# EAGLE design power_hub (EAGLE 9.1.0)
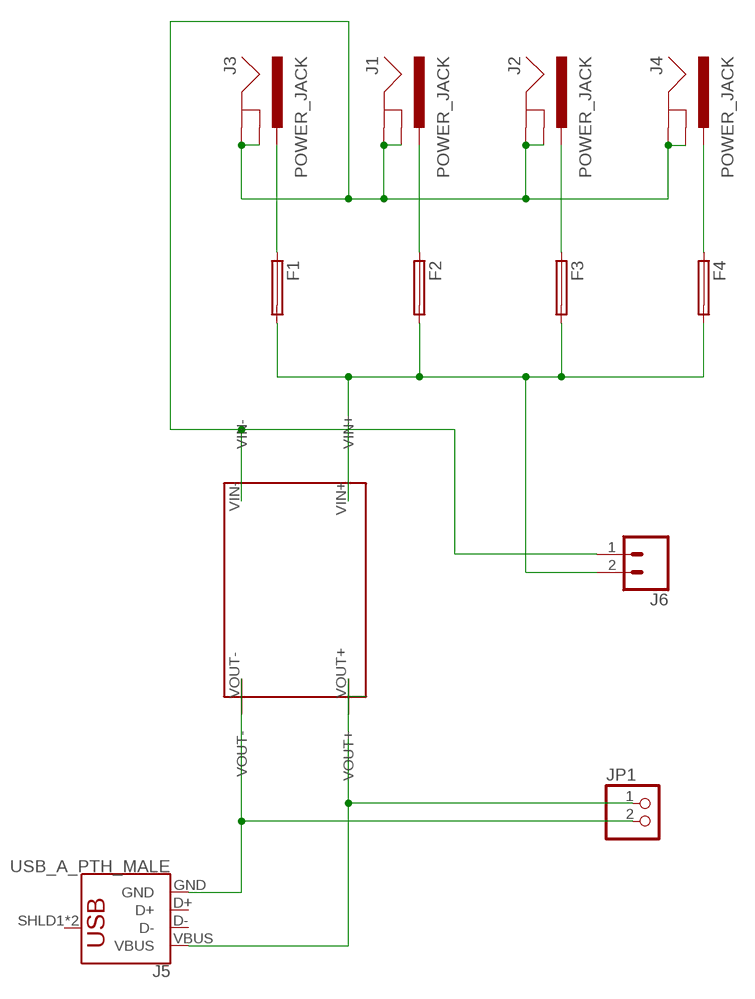
[diagram p0: schematic, sheet 1]

## Parts
F1  GSH15  [GSH15]
F2  GSH15  [GSH15]
F3  GSH15  [GSH15]
F4  GSH15  [GSH15]
J1  POWER_JACK  [POWER_JACK_PTH]
J2  POWER_JACK  [POWER_JACK_PTH]
J3  POWER_JACK  [POWER_JACK_PTH]
J4  POWER_JACK  [POWER_JACK_PTH]
J5  USB_A_PTH_MALE  [USB-A-H]
J6  CONN_023.5MM  [SCREWTERMINAL-3.5MM-2]
JP1  PINHD-1X2  [1X02]
U$1  DCPOWERCONV_PHUB  [DCPOWERCONV_PHUB]

## Nets
N$1: F1.1 J3.PWR
N$2: F2.1 J1.PWR
N$3: F3.1 J2.PWR
N$4: J5.VBUS JP1.1 U$1.VOUT+
N$5: F1.2 F2.2 F3.2 F4.2 J6.2 U$1.VIN+
N$6: F4.1 J4.PWR
N$9: J5.GND JP1.2 U$1.VOUT-
N$10: J1.GND J1.GNDBREAK J2.GND J2.GNDBREAK J3.GND J3.GNDBREAK J4.GND J4.GNDBREAK J6.1 U$1.VIN-
Unconnected: J5.D+ J5.D- J5.SHLD1(SHIELD) J5.SHLD2(SHIELD)

## Library data of the parts
F1-F4 = fuse:GSH15: FUSE HOLDER grid 15mm, 19649 Wickmann; MPN: 64900001039; OC_FARNELL: 1271673; OC_NEWARK: 02P0318
J1-J4 = SparkFun-Connectors:POWER_JACK: Power Jack Connector This is the standard 5.5mm barrel jack for power. The PTH is the most common, proven, reliable, footprint. The Slot footprint only works if the mill layer is transmitted to the PCB fab house so be warned. Here are the connectors we sell at SparkFun: DC Barrel Power Jack/Connector <https://www.sparkfun.com/products/119> (PRT-00119) DC Barrel Power Jack/Connector (SMD) <https://www.sparkfun.com/products/12748> (PRT-12748) DC Barrel Jack Adapter - Breadboard Compatible <https://www.sparkfun.com/products/10811> (PRT-10811) It is used on this SparkFun product (and many, many others): SparkFun RedBoard - Programmed with Arduino <https://www.sparkfun.com/products/12757> (DEV-12757) Also, if you need a mating power supply or connector, please check these out: Wall Adapter Power Supply - 9VDC 650mA <https://www.sparkfun.com/products/298> (TOL-00298) DC Barrel Jack Adapter - Male <https://www.sparkfun.com/products/10287> (PRT-10287); PROD_ID: CONN-08197
J5 = SparkFun-Connectors:USB_A: USB-A Connector Male and female variants, as well as PTH and SMT variants SparkFun Products: SparkFun XBee Explorer Dongle <https://www.sparkfun.com/products/11697> PTH Male SparkFun MicroView-USB Programmer <https://www.sparkfun.com/products/12924> SMT Male SparkFun USB Type A Female Breakout <https://www.sparkfun.com/products/12700> SMT Female; PROD_ID: CONN-08367; SF_ID: PRT-00437
J6 = SparkFun-Connectors:CONN_02: Multi connection point. Often used as Generic Header-pin footprint for 0.1 inch spaced/style header connections On any of the 0.1 inch spaced packages, you can populate with these: Break Away Headers - Straight <https://www.sparkfun.com/products/116> (PRT-00116) Break Away Male Headers - Right Angle <https://www.sparkfun.com/products/553> (PRT-00553) Female Headers <https://www.sparkfun.com/products/115> (PRT-00115) Break Away Headers - Machine Pin <https://www.sparkfun.com/products/117> (PRT-00117) Break Away Female Headers - Swiss Machine Pin <https://www.sparkfun.com/products/743> (PRT-00743) For SCREWTERMINALS and SPRING TERMINALS visit here: Screw Terimnals on SparkFun.com <https://www.sparkfun.com/search/results?term=Screw+Terminals> (5mm/3.5mm/2.54mm spacing) This device is also useful as a general connection point to wire up your design to another part of your project. Our various solder wires solder well into these plated through hole pads. Hook-Up Wire - Assortment (Stranded, 22 AWG) <https://www.sparkfun.com/products/11375> (PRT-11375) Hook-Up Wire - Assortment (Solid Core, 22 AWG) <https://www.sparkfun.com/products/11367> (PRT-11367) View the entire wire category on our website here <https://www.sparkfun.com/categories/141> Special notes: Molex polarized connector foot print use with: PRT-08233 with associated crimp pins and housings. 2.54_SCREWTERM for use with PRT-10571. 3.5mm Screw Terminal footprints for PRT-08084 5mm Screw Terminal footprints for use with PRT-08432; PROD_ID: CONN-08399
JP1 = pinhead:PINHD-1X2: PIN HEADER
U$1 = astropipower:DCPOWERCONV_PHUB: DC to DC Power Converter

## Board
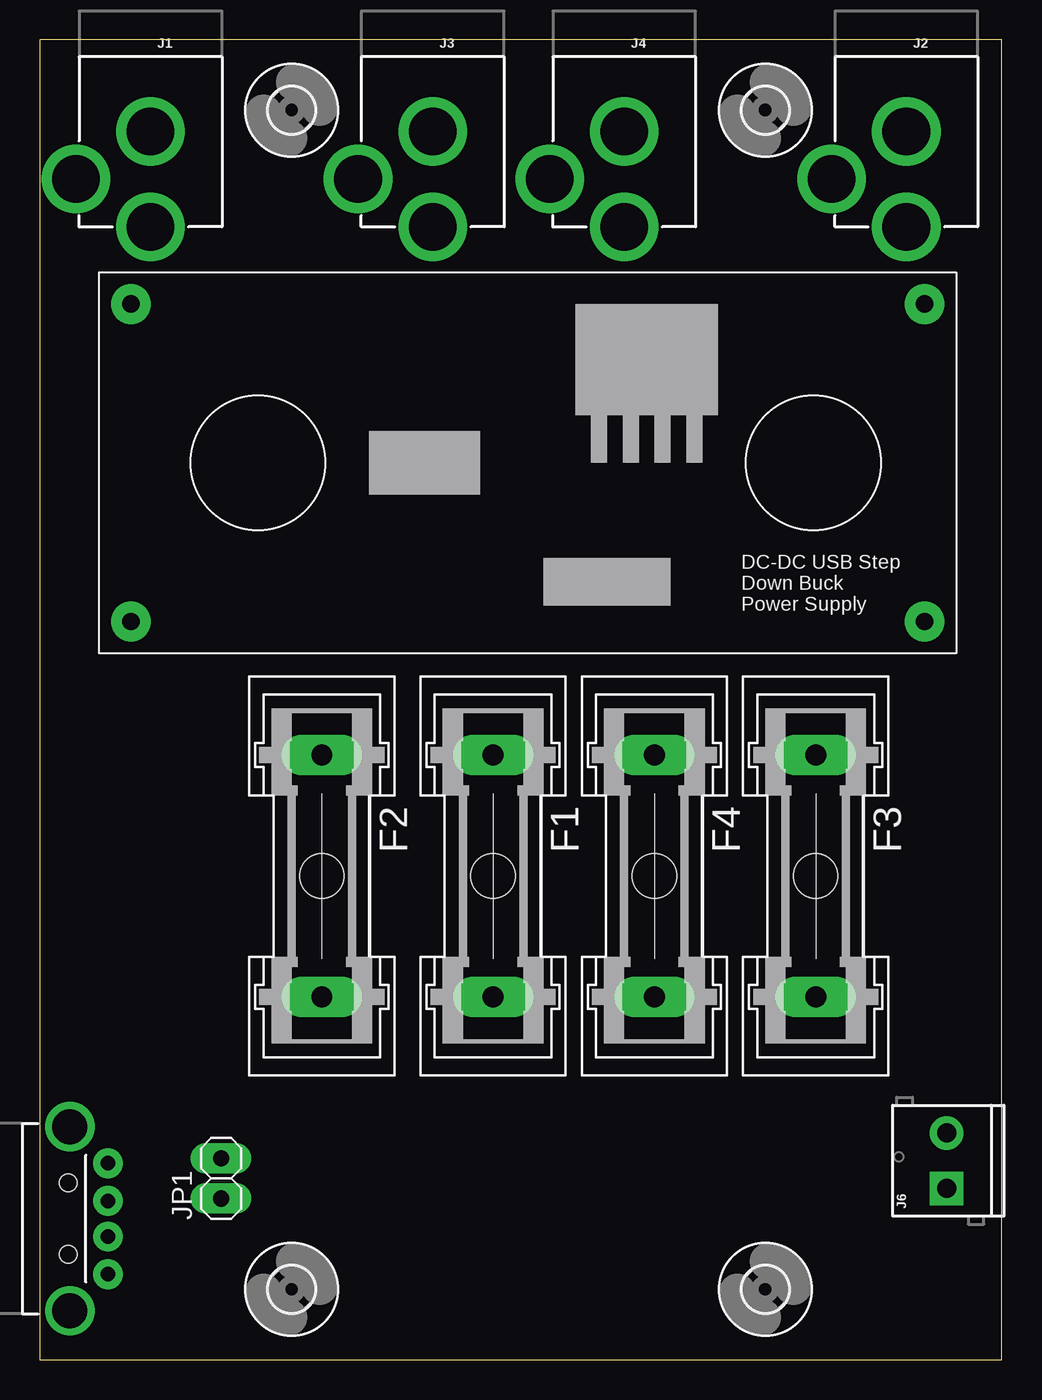
[diagram p1: board, top side]
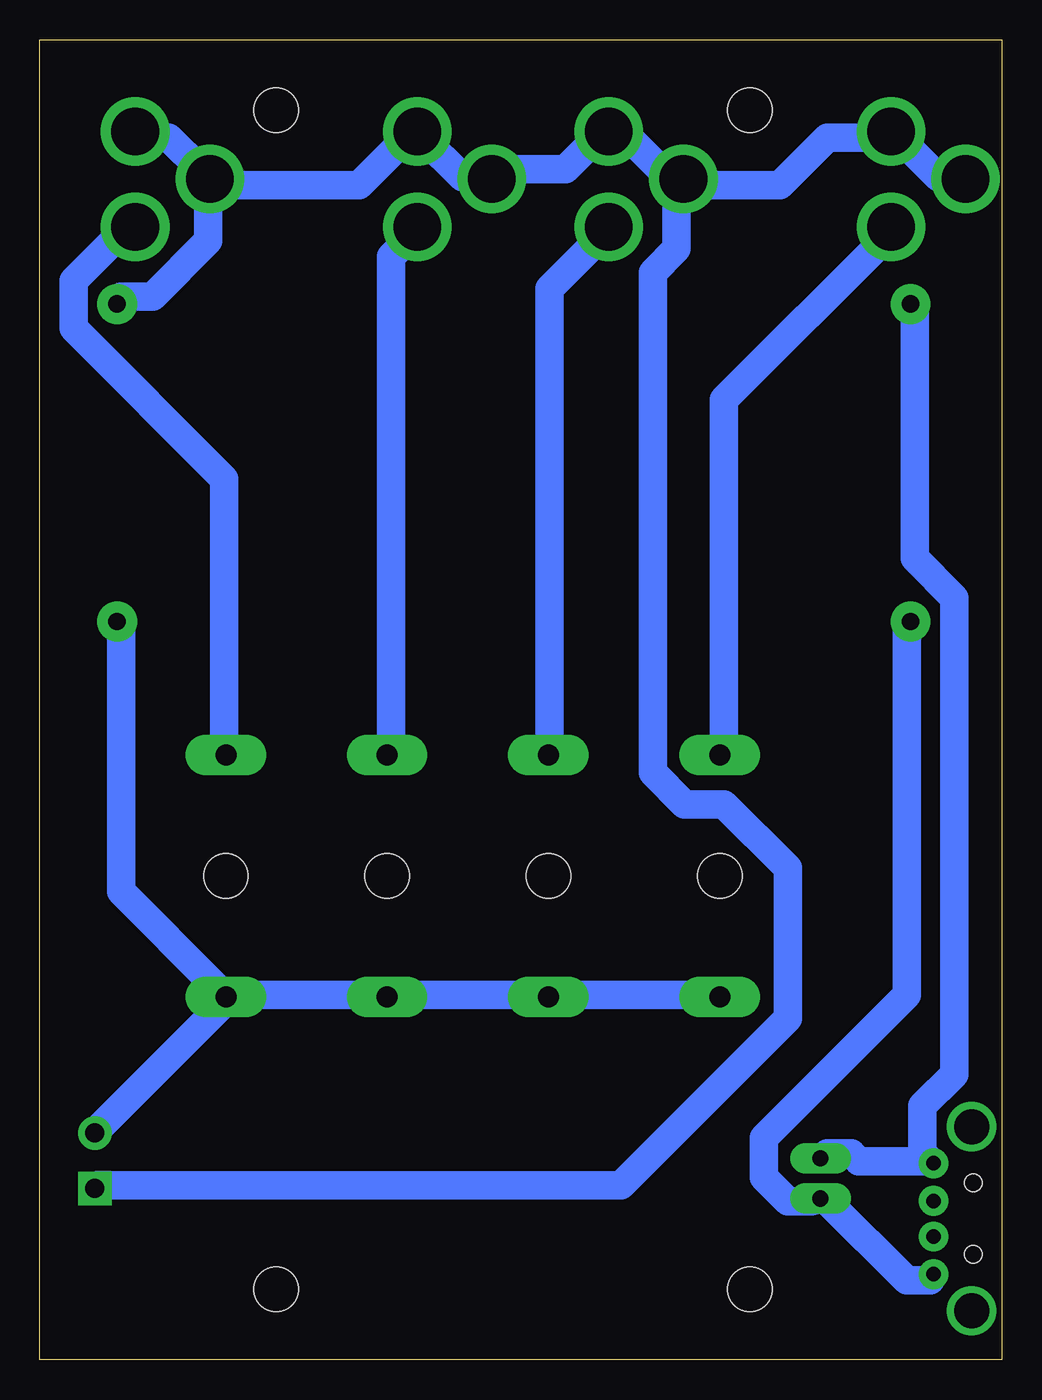
[diagram p2: board, bottom side, seen from below]

Size 60.63 x 83.17 mm. Coordinates in mm from the lower left corner, seen from the top.
Outline: 0,0 60.63,0 60.63,83.17 0,83.17 0,0
Copper layers (1*16): Top 0.035mm / dielectric 1.5mm / Bottom 0.035mm
Design rules "diy_board_drcs *": minimum track width 1.8mm, minimum drill 0.8mm, track to track 0.8mm, track to pad 0.6mm, pad to pad 0.3mm, via to via 1mm, smd to smd 8mil, copper to edge 40mil, drill to drill 8mil, minimum pad ring 0.4mm, minimum via ring 0.6mm, stop-mask expansion 4mil, vias tented up to drill 0mil, thermal gap 10mil

### Footprints (pad centres in the part's own frame; a part is rotated, then mirrored left to right if it is on the bottom)
GSH15 = drill 1.321 pad 2.54 long: 1 -7.62,0; 2 7.62,0 | hole 2.794: 0,0
POWER_JACK_PTH = drill 2.997 pad 4.318: GND 0,7.7; GNDBREAK 4.7,10.7; PWR 0,13.7
USB-A-H = drill 0.914 pad 1.88: D+ 2.4,1.127; D- 2.4,-1.127; GND 2.4,3.5; VBUS 2.4,-3.5 | drill 2.2: SHLD1 0,-5.8; SHLD2 0,5.8 | hole 1.1: -0.1,2.25; -0.1,-2.25
SCREWTERMINAL-3.5MM-2 = drill 1.2 pad 2.032 square: 1 0,0 | drill 1.2 pad 2.032: 2 3.5,0
1X02 = drill 1.016 long: 1 -1.27,0; 2 1.27,0
DCPOWERCONV_PHUB = drill 1.1 pad 2.5: VIN+ 10,24; VIN- -10,24; VOUT+ 10,-26; VOUT- -10,-26
2,8 = hole 2.8: 0,0

### Placement (x,y rotation side)
F1  28.57,30.48 270 top
F2  17.78,30.48 270 top
F3  48.9,30.48 270 top
F4  38.73,30.48 270 top
J1  6.99,85.09 180 top
J2  54.61,85.09 180 top
J3  24.77,85.09 180 top
J4  36.83,85.09 180 top
J5  1.91,8.89 0 top
J6  57.15,10.79 90 top
JP1  11.43,11.43 90 top
U$1  31.75,56.52 270 top
U$2  [2,8]  45.72,4.45 0 top
U$3  [2,8]  45.72,78.74 0 top
U$4  [2,8]  15.88,4.45 0 top
U$5  [2,8]  15.88,78.74 0 top

### Tracks (layer width: path | path; a pad name or v marks a point on that pad's centre or on a via)
N$1
  Bottom 1.8: F1.1 28.5,38.5 28.5,67.5 25,71 J3.PWR
N$2
  Bottom 1.8: F2.1 17.5,38.5 17.5,60.5 7,71 J1.PWR
N$3
  Bottom 1.8: F3.1 49,38.5 49,55.5 58.5,65 58.5,68 55,71.5 J2.PWR
N$4
  Bottom 1.8: J5.VBUS 4.5,5 6,5 11,10 JP1.1 12,10 13.5,10 15,11.5 15,14 6,23 6,46.5 U$1.VOUT+
N$5
  Bottom 1.8: F2.2 18,23 28.5,23 F1.2 29,23 38,23 F4.2 39,23 48,23 F3.2 | J6.2 57,14.5 49,22.5 F3.2 | U$1.VIN+ 55.5,46.5 55.5,29.5 49.5,23.5 F3.2
N$6
  Bottom 1.8: F4.1 38.5,38.5 38.5,69.5 37,71 J4.PWR
N$9
  Bottom 1.8: JP1.2 11,13 9.5,13 9,12.5 4.5,12.5 J5.GND 5,13 5,16 3,18 3,48 5.5,50.5 5.5,66.5 U$1.VOUT-
N$10
  Bottom 1.8: U$1.VIN- 55.5,67 53.5,67 50,70.5 50,74 J2.GNDBREAK | J2.GND 54.5,77 52.5,77 50.5,75 J2.GNDBREAK | J1.GNDBREAK 2.5,74.5 4,74.5 6.5,77 J1.GND 7.5,77 11,77 14,74 19.5,74 J3.GNDBREAK | J6.1 57,11 24,11 13.5,21.5 13.5,31 17.5,35 20,35 22,37 22,68.5 20.5,70 20.5,74 J3.GNDBREAK | J3.GNDBREAK 21,74.5 23.5,77 24.5,77 J3.GND 25.5,77 27.5,75 31.5,75 J4.GNDBREAK 32.5,74.5 34,74.5 36.5,77 J4.GND 37.5,77 40.5,74 49.5,74 J2.GNDBREAK